# EAGLE design mainboard (EAGLE 7.6.0)
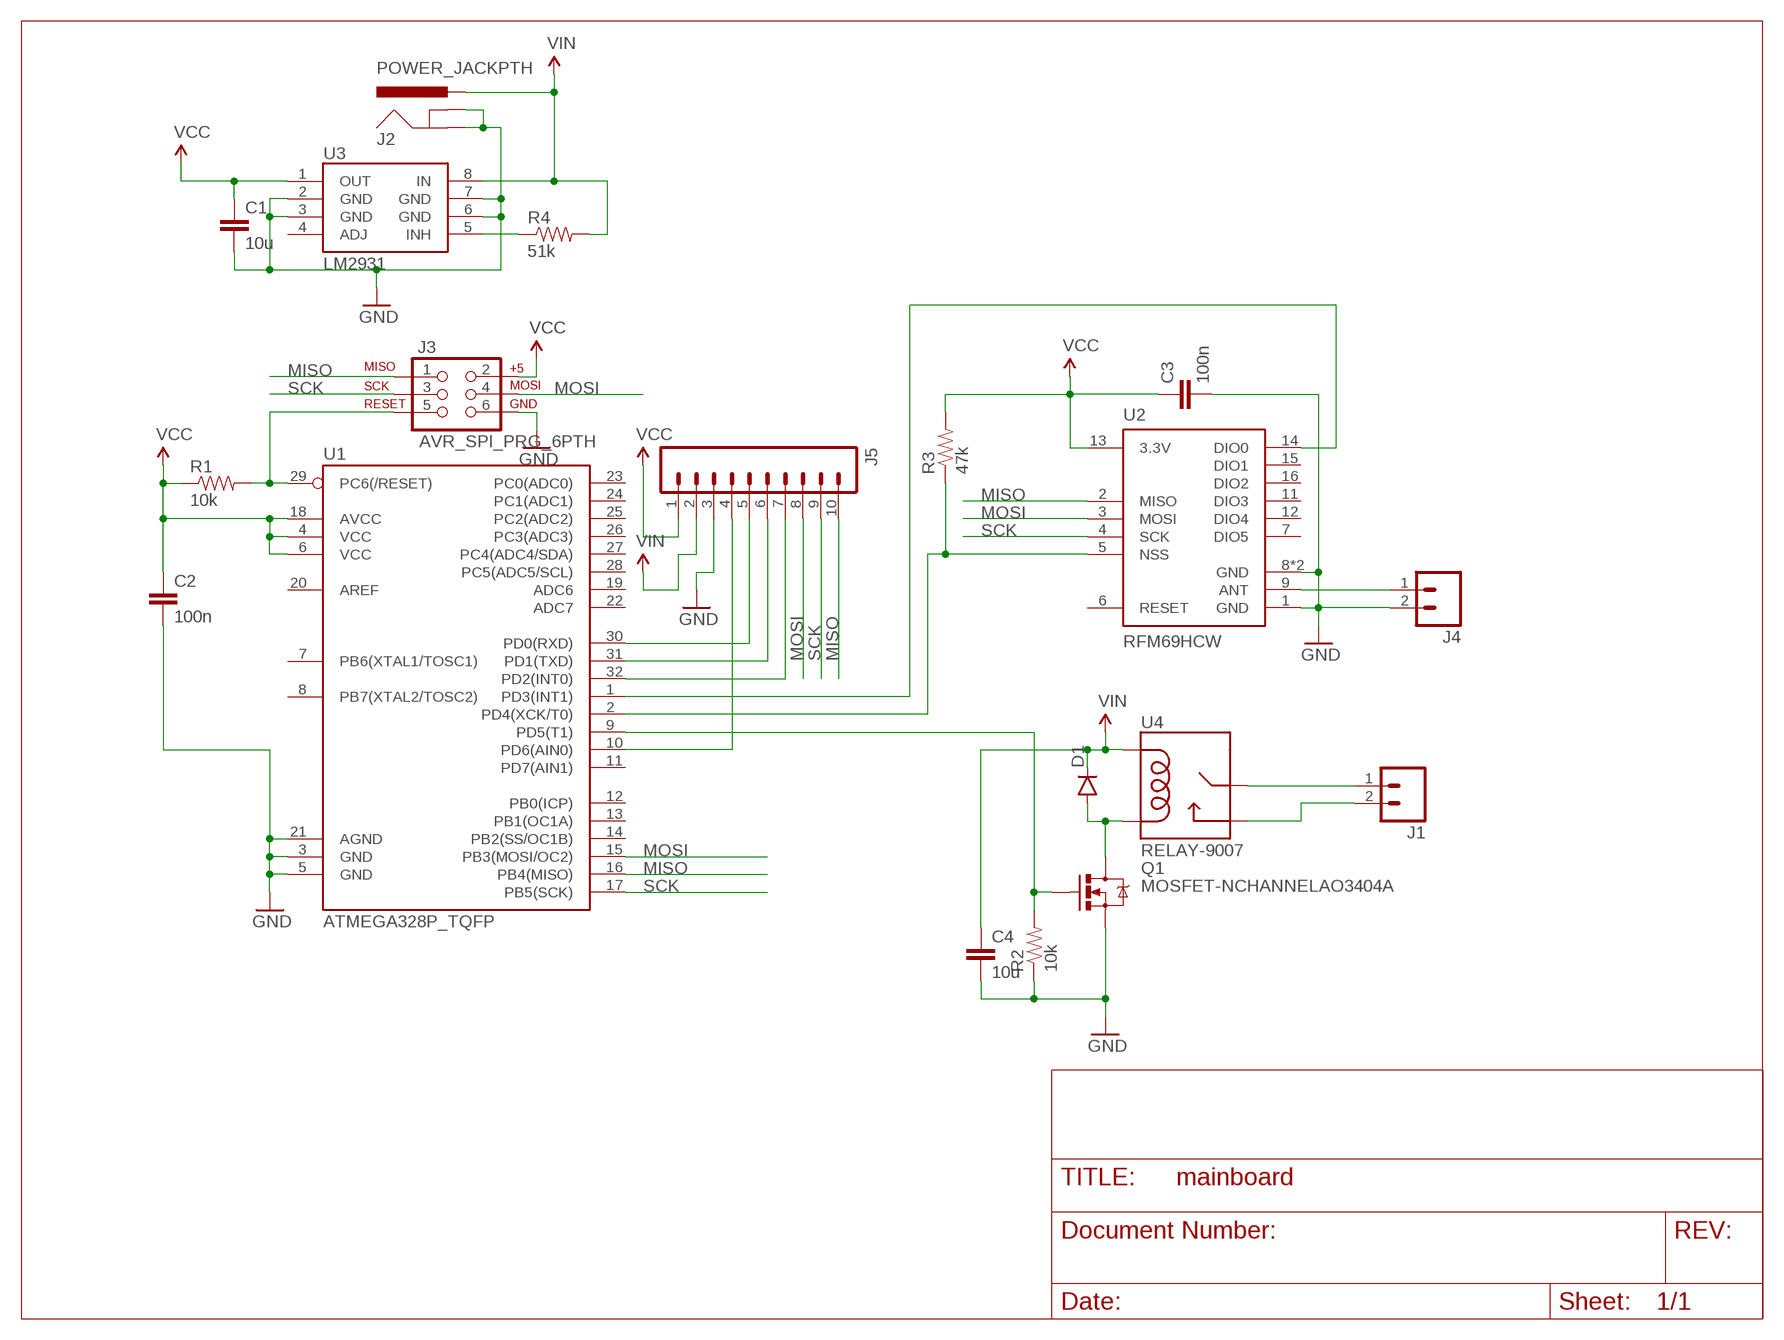
[diagram p0: schematic, sheet 1]

## Parts
C1  10u  CAP1206  [1206]
C2  100n  CAP0603-CAP  [0603-CAP]
C3  100n  CAP0603-CAP  [0603-CAP]
C4  10u  CAP1206  [1206]
D1  DIODEBAS16  [SOD-323]
J1  M025MM  [SCREWTERMINAL-5MM-2]
J2  POWER_JACKPTH  [POWER_JACK_PTH]
J3  AVR_SPI_PRG_6PTH  [2X3]
J4  M02PTH  [1X02]
J5  M10SILK_FEMALE_PTH  [1X10]
Q1  MOSFET-NCHANNELAO3404A  [SOT23-3]
R1  10k  RESISTOR0603-RES  [0603-RES]
R2  10k  RESISTOR0603-RES  [0603-RES]
R3  47k  RESISTOR0603-RES  [0603-RES]
R4  51k  RESISTOR0603-RES  [0603-RES]
U1  ATMEGA328P_TQFP  [TQFP32-08]
U2  RFM69HCW  [RFM69HCW-XXXS2]
U3  LM2931  [SO08]
U4  RELAY-9007  [RELAY-9007]

## Nets
GND: C1.2 C2.2 C3.2 C4.2 J2.GND J2.GNDBREAK J3.6 J4.2 J5.3 Q1.2(S) R2.1 U1.3(GND) U1.5(GND) U1.21(AGND) U2.1(GND) U2.8(GND) U2.10(GND) U3.2(GND) U3.3(GND) U3.6(GND) U3.7(GND)
MISO: J3.1 J5.10 U1.16(PB4(MISO)) U2.2(MISO)
MOSI: J3.4 J5.8 U1.15(PB3(MOSI/OC2)) U2.3(MOSI)
N$1: R3.1 U1.2(PD4(XCK/T0)) U2.5(NSS)
N$2: J3.5 R1.2 U1.29(PC6(/RESET))
N$3: U1.1(PD3(INT1)) U2.14(DIO0)
N$4: J4.1 U2.9(ANT)
N$5: J1.1 U4.1(MAIN)
N$6: J1.2 U4.4(NO)
N$7: D1.A Q1.3(D) U4.3(COIL2)
N$8: Q1.1(G) R2.2 U1.9(PD5(T1))
N$9: J5.7 U1.32(PD2(INT0))
N$10: J5.6 U1.31(PD1(TXD))
N$11: J5.5 U1.30(PD0(RXD))
N$12: J5.4 U1.10(PD6(AIN0))
N$19: R4.1 U3.5(INH)
SCK: J3.3 J5.9 U1.17(PB5(SCK)) U2.4(SCK)
VCC: C1.1 C2.1 C3.1 J3.2 J5.1 R1.1 R3.2 U1.4(VCC) U1.6(VCC) U1.18(AVCC) U2.13(3.3V) U3.1(OUT)
VIN: C4.1 D1.C J2.PWR J5.2 R4.2 U3.8(IN) U4.2(COIL1)
Unconnected: U1.7(PB6(XTAL1/TOSC1)) U1.8(PB7(XTAL2/TOSC2)) U1.11(PD7(AIN1)) U1.12(PB0(ICP)) U1.13(PB1(OC1A)) U1.14(PB2(SS/OC1B)) U1.19(ADC6) U1.20(AREF) U1.22(ADC7) U1.23(PC0(ADC0)) U1.24(PC1(ADC1)) U1.25(PC2(ADC2)) U1.26(PC3(ADC3)) U1.27(PC4(ADC4/SDA)) U1.28(PC5(ADC5/SCL)) U2.6(RESET) U2.7(DIO5) U2.11(DIO3) U2.12(DIO4) U2.15(DIO1) U2.16(DIO2) U3.4(ADJ)

## Library data of the parts
C1-C4 = SparkFun-Passives:CAP: Capacitor Standard 0603 ceramic capacitor, and 0.1" leaded capacitor.
D1 = SparkFun-DiscreteSemi:DIODE: Diode These are standard reverse protection diodes and small signal diodes. SMA package can handle up to about 1A. SOD-323 can handle about 200mA. What the SOD-323 package when ordering, there are some mfgs out there that are 5-pin packages.; PROD_ID: DIO-09646; VALUE: 250mA/100V
J1 = SparkFun-Connectors:M02: Standard 2-pin 0.1" header. Use with - straight break away headers ( PRT-00116) - right angle break away headers (PRT-00553) - swiss pins (PRT-00743) - machine pins (PRT-00117) - female headers (PRT-00115) Molex polarized connector foot print use with: PRT-08233 with associated crimp pins and housings. 2.54_SCREWTERM for use with PRT-10571. 3.5mm Screw Terminal footprints for PRT-08084 5mm Screw Terminal footprints for use with PRT-08432; STOREFRONT_ID: PRT-08432
J2 = SparkFun-Connectors:POWER_JACK: Power Jack This is the standard 5.5mm barrel jack for power. The PTH is the most common, proven, reliable, footprint. The Slot footprint only works if the mill layer is transmitted to the PCB fab house so be warned. Mating wall wart : TOL-00298 (and others); PROD_ID: CONN-08197
J3 = SparkFun-Connectors:AVR_SPI_PRG_6: AVR ISP 6 Pin This is the reduced ISP connector for AVR programming. Common on Arduino. This footprint will take up less PCB space and can be used with a 10-pin to 6-pin adapter such as SKU: BOB-08508 **Special note about "TEST_POINT" package. The stop mask is on the top side, so if you want your programming test points to be on the bottom of your board, make sure to place this package on the bottom side of the board. This also ensure that the orientation to program from the bottom side will be correct.
J4 = SparkFun-Connectors:M02: Standard 2-pin 0.1" header. Use with - straight break away headers ( PRT-00116) - right angle break away headers (PRT-00553) - swiss pins (PRT-00743) - machine pins (PRT-00117) - female headers (PRT-00115) Molex polarized connector foot print use with: PRT-08233 with associated crimp pins and housings. 2.54_SCREWTERM for use with PRT-10571. 3.5mm Screw Terminal footprints for PRT-08084 5mm Screw Terminal footprints for use with PRT-08432
J5 = SparkFun-Connectors:M10: Header 10 Standard 10-pin 0.1" header. Use with straight break away headers (SKU : PRT-00116), right angle break away headers (PRT-00553), swiss pins (PRT-00743), machine pins (PRT-00117), and female headers (PRT-00115).; PROD_ID: CONN-11563
Q1 = SparkFun-DiscreteSemi:MOSFET-NCHANNEL: Common NMOSFET Parts MFG P/N Store ID Prod ID FDD8780 TRANS-09984 SI7820DN TRANS-11055 FDS6630A IC-08089 2N7002PW TRANS-11151 FQP30N06L COM-10213 TRANS-10060 BSS123LT1G TRANS-08345 BSS138 TRANS-00830 BS170 2N7000; PROD_ID: TRAN-12988
R1-R4 = SparkFun-Passives:RESISTOR: Resistor Basic schematic elements and footprints for 0603, 1206, and PTH resistors.
U1 = SparkFun-DigitalIC:ATMEGA328P_TQFP; PROD_ID: IC-09069
U2 = SparkFun-RF:RFM69H; PROD_ID: IC-11997, IC-12053
U3 = SparkFun-PowerIC:LM2931: LDO regulator with reverse battery protection- very durable!
U4 = Electromechanical:RELAY-9007

## Board
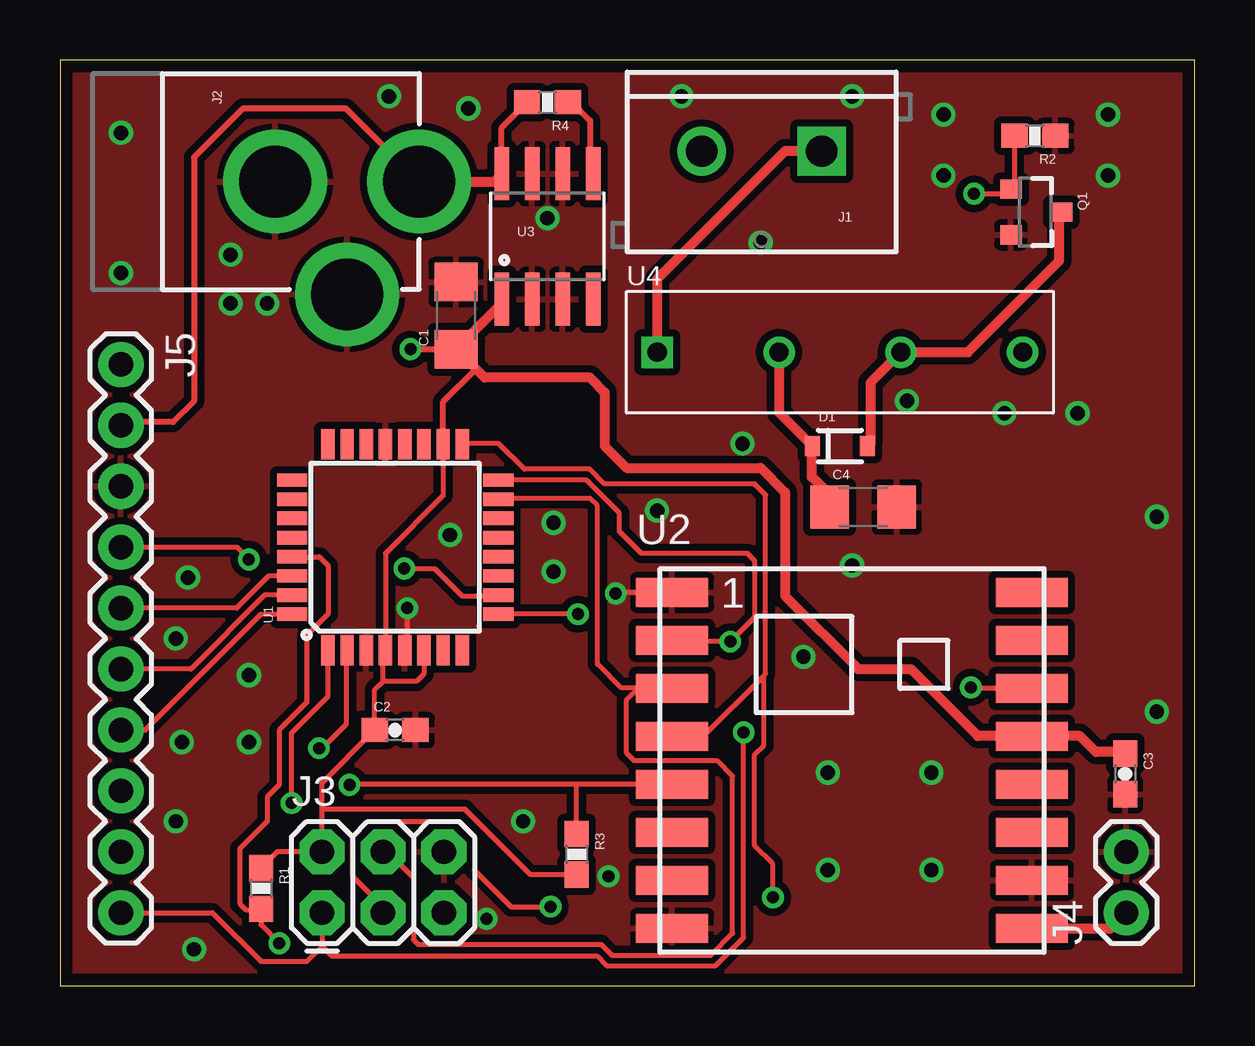
[diagram p1: board, top side]
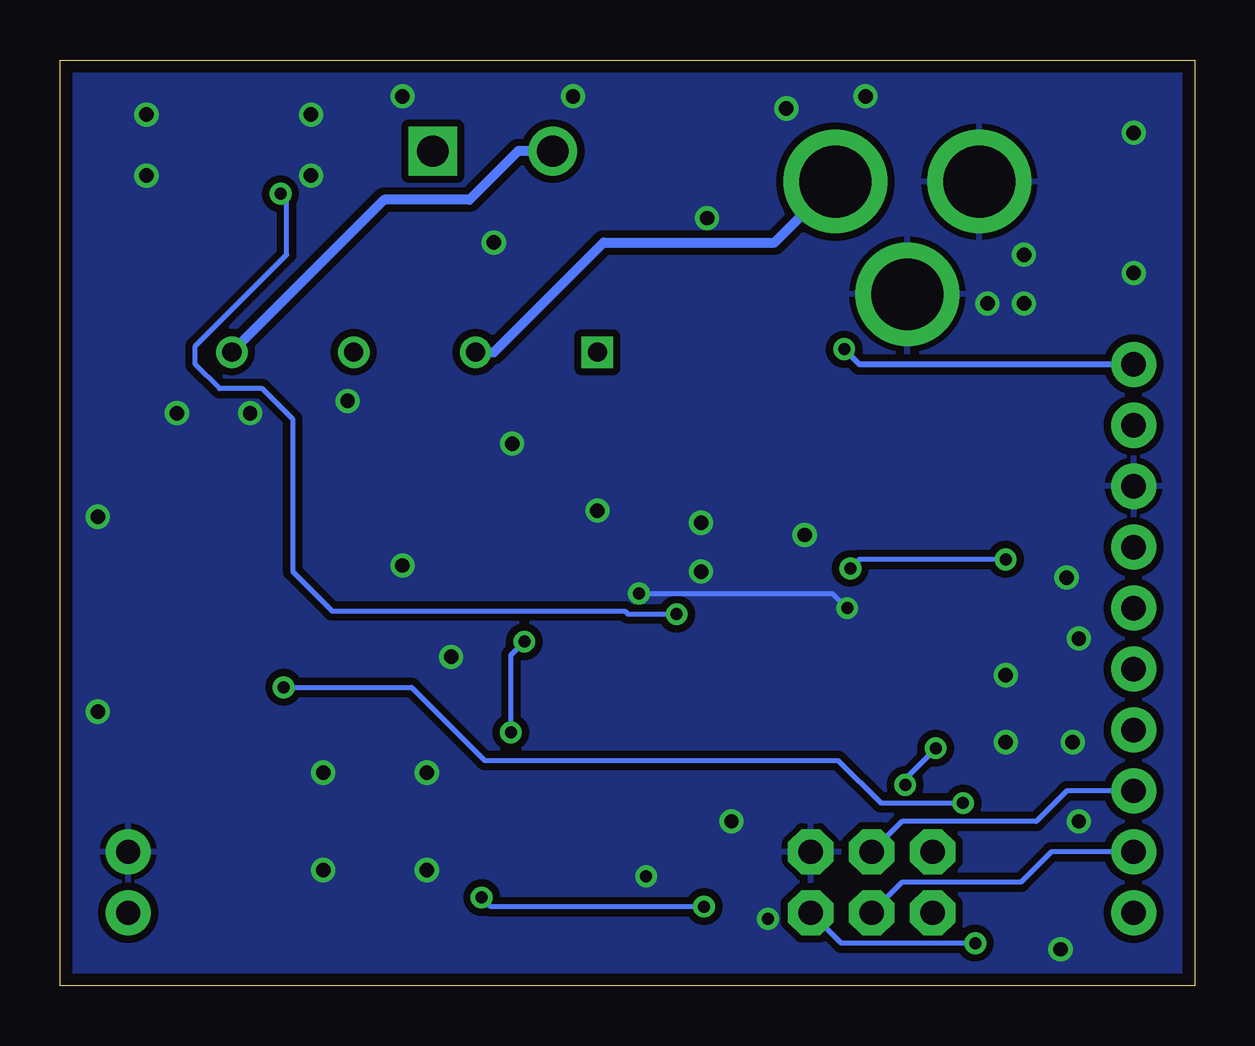
[diagram p2: board, bottom side, seen from below]

Size 47.3 x 38.6 mm. Coordinates in mm from the lower left corner, seen from the top.
Outline: 0,0 47.3,0 47.3,38.6 0,38.6 0,0
Copper layers (1*16): Top 0.035mm / dielectric 1.5mm / Bottom 0.035mm
Design rules "default *": minimum track width 8mil, minimum drill 15mil, track to track 8mil, track to pad 8mil, pad to pad 8mil, via to via 8mil, smd to smd 8mil, copper to edge 20mil, drill to drill 8mil, minimum pad ring 10mil, minimum via ring 8mil, stop-mask expansion 4mil, vias tented up to drill 0mil, thermal gap 10mil

### Footprints (pad centres in the part's own frame; a part is rotated, then mirrored left to right if it is on the bottom)
1206 = smd 1.6 x 1.8: 1 -1.4,0; 2 1.4,0
0603-CAP = smd 1.1 x 1: 1 -0.85,0; 2 0.85,0
SOD-323 = smd 0.63 x 0.83: A 1.15,0; C -1.15,0
SCREWTERMINAL-5MM-2 = drill 1.3 pad 2.032 square: 1 0,0 | drill 1.3 pad 2.032: 2 5,0
POWER_JACK_PTH = drill 2.997 pad 4.318: GND 0,7.7; GNDBREAK 4.7,10.7; PWR 0,13.7
2X3 = drill 1.016 pad 1.88 octagon: 1 0,0; 2 0,2.54; 3 2.54,0; 4 2.54,2.54; 5 5.08,0; 6 5.08,2.54
1X02 = drill 1.016 pad 1.88: 1 0,0; 2 2.54,0
1X10 = drill 1.016 pad 1.88: 1 0,0; 2 2.54,0; 3 5.08,0; 4 7.62,0; 5 10.16,0; 6 12.7,0; 7 15.24,0; 8 17.78,0; 9 20.32,0; 10 22.86,0
SOT23-3 = smd 0.8 x 0.9: 1 -0.95,-1; 2 0.95,-1; 3 0,1.1
0603-RES = smd 1.1 x 1: 1 -0.85,0; 2 0.85,0
TQFP32-08 = smd 1.27 x 0.559: 1 -4.293,2.8; 2 -4.293,2; 3 -4.293,1.2; 4 -4.293,0.4; 5 -4.293,-0.4; 6 -4.293,-1.2; 7 -4.293,-2; 8 -4.293,-2.8; 17 4.293,-2.8; 18 4.293,-2; 19 4.293,-1.2; 20 4.293,-0.4; 21 4.293,0.4; 22 4.293,1.2; 23 4.293,2; 24 4.293,2.8 | smd 0.559 x 1.27: 9 -2.8,-4.293; 10 -2,-4.293; 11 -1.2,-4.293; 12 -0.4,-4.293; 13 0.4,-4.293; 14 1.2,-4.293; 15 2,-4.293; 16 2.8,-4.293; 25 2.8,4.293; 26 2,4.293; 27 1.2,4.293; 28 0.4,4.293; 29 -0.4,4.293; 30 -1.2,4.293; 31 -2,4.293; 32 -2.8,4.293
RFM69HCW-XXXS2 = smd 3 x 1.2: 1 -7.5,7; 2 -7.5,5; 3 -7.5,3; 4 -7.5,1; 5 -7.5,-1; 6 -7.5,-3; 7 -7.5,-5; 8 -7.5,-7; 9 7.5,-7; 10 7.5,-5; 11 7.5,-3; 12 7.5,-1; 13 7.5,1; 14 7.5,3; 15 7.5,5; 16 7.5,7
SO08 = smd 0.61 x 2.21: 1 -1.905,-2.616; 2 -0.635,-2.616; 3 0.635,-2.616; 4 1.905,-2.616; 5 1.905,2.616; 6 0.635,2.616; 7 -0.635,2.616; 8 -1.905,2.616
RELAY-9007 = drill 0.8 square: 1 -7.62,0 | drill 0.8: 2 -2.54,0; 3 2.54,0; 4 7.62,0

### Placement (x,y rotation side)
C1  16.51,27.94 90 top
C2  13.97,10.67 0 top
C3  44.4,8.84 270 top
C4  33.48,19.96 0 top
D1  32.51,22.5 0 top
J1  31.75,34.8 180 top
J2  1.27,33.53 270 top
J3  10.92,3.05 0 top
J4  44.45,3.05 90 top
J5  2.54,25.91 270 top
Q1  40.64,32.26 270 top
R1  8.38,4.06 270 top
R2  40.64,35.43 180 top
R3  21.54,5.49 270 top
R4  20.32,36.83 180 top
U1  13.97,18.29 90 top
U2  33.02,9.4 0 top
U3  20.32,31.24 0 top
U4  32.51,26.42 0 top

### Tracks (layer width: path | path; a pad name or v marks a point on that pad's centre or on a via)
GND  (via drill 0.5, 0.6)
  Top 0.203: U2.1 23.2,16.4 v23.16,16.36 | v14.48,15.75 14.48,14.1 U1.5
  Bottom 0.203: v23.16,16.36 15.09,16.36 v14.48,15.75
  other vias: 7.11,30.48 7.11,28.45 8.64,28.45 25.91,37.08 33.02,37.08 36.83,36.32 36.83,33.78 43.69,36.32 43.69,33.78 29.21,30.99 35.31,24.38 39.37,23.88 42.42,23.88 32,8.89 36.32,8.89 32,4.83 36.32,4.83 22.86,4.57 17.78,2.79 5.33,17.02 4.83,14.48 7.87,12.95 5.08,10.16 7.87,10.16 19.3,6.86 4.83,6.86 5.59,1.52 16.26,18.8 20.57,19.3 20.57,17.27 24.89,19.81 28.45,22.61 33.02,17.53 30.99,13.72 45.72,19.56 45.72,11.43 2.54,35.56 2.54,29.72 13.72,37.08 17.02,36.58 20.32,32
  pour Bottom (isolate 0.305): 0,38.61 47.24,38.61 47.24,0 0,0
  pour Top (isolate 0.305): 0,38.61 47.24,38.61 47.24,0 0,0
MISO  (via drill 0.5)
  Top 0.203: U1.16 21.95,21.08 23.32,19.71 23.32,18.95 24.23,18.03 28.65,18.03 28.96,17.73 28.96,15.37 v27.94,14.35 25.57,14.35 U2.2 | J3.1 10.92,1.65 | 10.92,1.65 11.33,1.25 22.38,1.25 22.78,0.84 27.33,0.84 28.5,2.01 v28.5,10.57 | J5.10 6.35,3.05 8.38,1.02 10.29,1.02 10.92,1.65
  Bottom 0.203: v28.5,10.57 28.5,13.79 v27.94,14.35
MOSI
  Top 0.203: U1.15 18.3,20.32 22.1,20.32 22.4,20.02 22.4,13.41 23.37,12.45 24.13,12.45 | J3.4 13.66,5.59 14.73,4.5 14.73,1.93 14.94,1.73 22.55,1.73 23.01,1.27 27.13,1.27 28.04,2.18 28.04,8.74 27.38,9.4 23.93,9.4 23.62,9.7 23.62,11.94 24.13,12.45 | 24.13,12.45 25.47,12.45 U2.3
  Bottom 0.203: J5.8 5.33,8.13 6.6,6.86 12.19,6.86 J3.4
N$1  (via drill 0.5)
  Top 0.203: U2.5 21.46,8.4 | 21.46,8.4 12.08,8.4 v12.06,8.38 | v10.79,9.91 10.92,9.91 11.94,10.92 11.94,13.96 U1.2 | R3.1 21.54,8.32 21.46,8.4
  Bottom 0.203: v12.06,8.38 12.06,8.64 v10.79,9.91
N$2  (via drill 0.5)
  Top 0.203: U1.29 10.81,17.89 11.18,17.53 11.18,15.49 10.29,14.61 10.29,11.81 9.14,10.67 9.14,8.38 8.64,7.87 8.64,6.86 7.49,5.71 7.49,3.43 7.75,3.17 8.34,3.17 R1.2 8.38,2.54 v9.14,1.78
  Bottom 0.203: v9.14,1.78 14.73,1.78 J3.5
N$3  (via drill 0.5)
  Top 0.203: U2.14 38.02,12.4 v37.97,12.45 | v9.65,7.62 9.65,10.54 11.18,12.07 U1.1
  Bottom 0.203: v37.97,12.45 32.64,12.45 29.59,9.4 14.86,9.4 13.08,7.62 v9.65,7.62
N$4
  Top 0.406: U2.9 43.8,2.4 J4.1
N$5
  Top 0.406: J1.1 30.23,34.8 24.89,29.46 U4.1
N$6
  Bottom 0.406: J1.2 28.19,34.8 30.23,32.77 33.78,32.77 U4.4
N$7
  Top 0.406: Q1.3 41.66,32.17 41.66,30.23 37.85,26.42 U4.3 33.78,25.15 33.78,22.62 D1.A
N$8  (via drill 0.5)
  Top 0.203: R2.2 39.79,33.36 Q1.1 39.45,33.02 v38.1,33.02 | v21.59,15.49 U1.9
  Bottom 0.203: v21.59,15.49 23.62,15.49 23.75,15.62 35.94,15.62 37.59,17.27 37.59,23.62 38.86,24.89 40.64,24.89 41.66,25.91 41.66,26.67 37.85,30.48 37.85,32.77 v38.1,33.02
N$9
  Top 0.203: J5.7 3.56,10.67 8.38,15.49 U1.32
N$10
  Top 0.203: U1.31 8.54,16.29 5.46,13.21 J5.6
N$11
  Top 0.203: U1.30 8.71,17.09 7.37,15.75 J5.5
N$12  (via drill 0.5)
  Top 0.203: J5.4 7.37,18.29 v7.87,17.78 | v14.35,17.4 15.62,17.4 16.76,16.26 18.23,16.26 U1.10
  Bottom 0.203: v7.87,17.78 13.97,17.78 v14.35,17.4
N$19
  Top 0.254: R4.1 21.34,36.83 22.1,36.07 22.1,33.98 U3.5
SCK  (via drill 0.5)
  Top 0.203: U2.4 26.81,10.4 29.34,12.93 | 29.34,12.93 29.41,13 29.41,20.47 28.96,20.93 22.71,20.93 22.1,21.54 19.36,21.54 18.29,22.61 16.8,22.61 U1.17 | J3.3 13.46,3.3 12.19,4.57 12.19,6.22 12.83,6.86 16.64,6.86 17.27,6.22 17.27,4.83 18.8,3.3 v20.45,3.3 | v29.72,3.68 29.72,5.08 28.96,5.84 28.96,9.65 29.34,10.03 29.34,12.93
  Bottom 0.203: v29.72,3.68 29.34,3.3 v20.45,3.3 | J5.9 5.97,5.59 7.24,4.32 12.19,4.32 J3.3
VCC  (via drill 0.5)
  Top 0.203: 13.46,12.7 13.12,12.36 C2.1 10.92,8.47 10.92,7.37 | 13.46,12.7 13.46,13.89 U1.4 13.56,18.03 15.97,20.44 U1.18 | 10.92,7.37 J3.2 9.06,5.59 R1.1 | R3.2 19.62,4.64 16.89,7.37 10.92,7.37 | U1.6 15.17,13.01 14.86,12.7 13.46,12.7
  Top 0.254: v14.61,26.54 C1.1 | U1.18 15.97,24.35 17.33,25.72
  Top 0.406: C3.1 44.4,9.75 43.18,9.75 42.52,10.41 40.54,10.41 | 40.54,10.41 38.25,10.41 35.46,13.21 33.27,13.21 30.23,16.26 30.23,20.57 29.21,21.59 23.62,21.59 22.71,22.5 22.71,24.74 22.1,25.35 17.7,25.35 17.33,25.72 C1.1 18.41,28.45 U3.1 | 40.54,10.41 U2.13
  Bottom 0.254: J5.1 13.97,25.91 v14.61,26.54
VIN
  Top 0.254: J5.2 2.67,23.49 4.7,23.49 5.59,24.38 5.59,34.54 7.62,36.58 11.92,36.58 J2.PWR | U3.8 18.41,35.78 R4.2
  Top 0.406: J2.PWR 18.09,33.53 U3.8 | U4.2 29.97,23.89 D1.C 31.34,22.49 31.34,21.21 31.47,21.08 31.5,21.08 32.08,20.5 C4.1
  Bottom 0.406: U4.2 29.21,26.42 24.64,30.99 17.51,30.99 J2.PWR